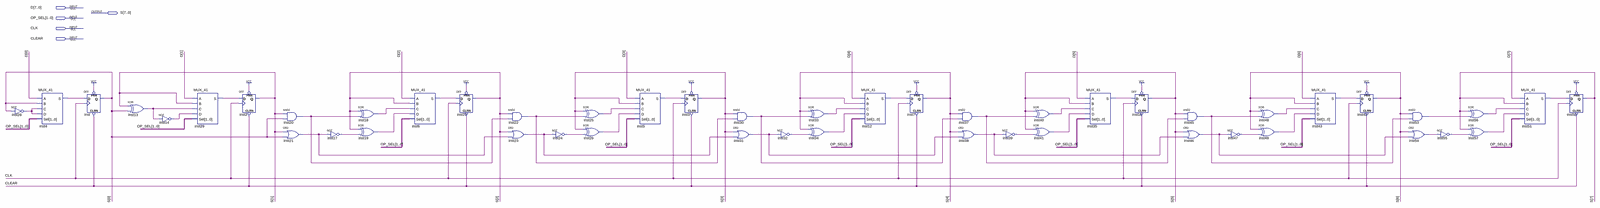
[diagram p0: schematic sheet, whole]
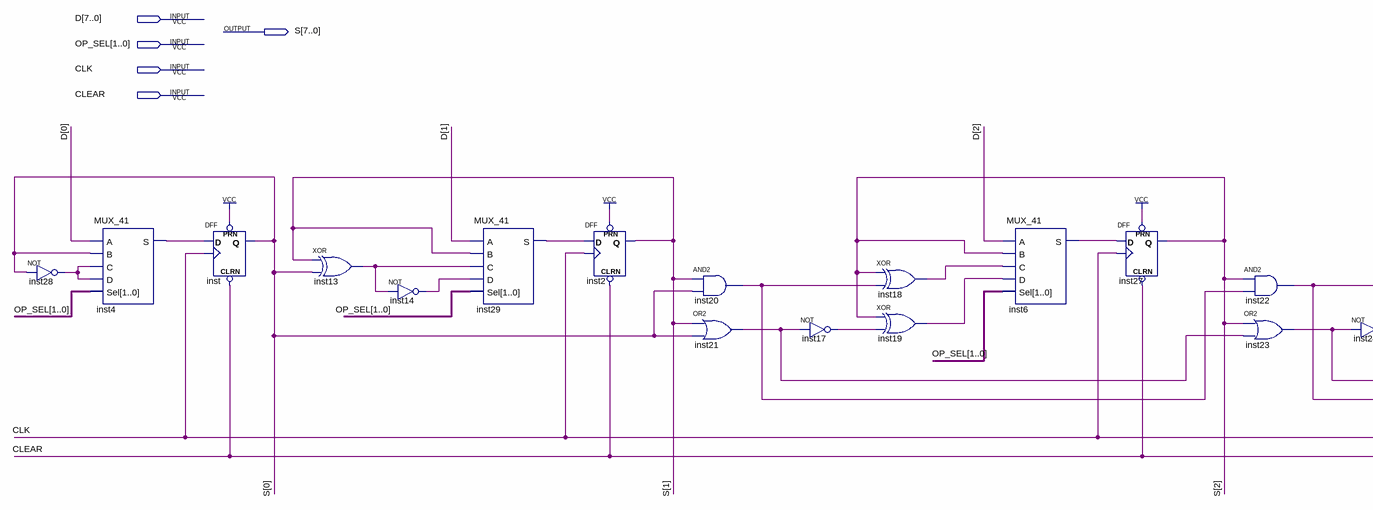
[diagram p1: schematic sheet, left part]
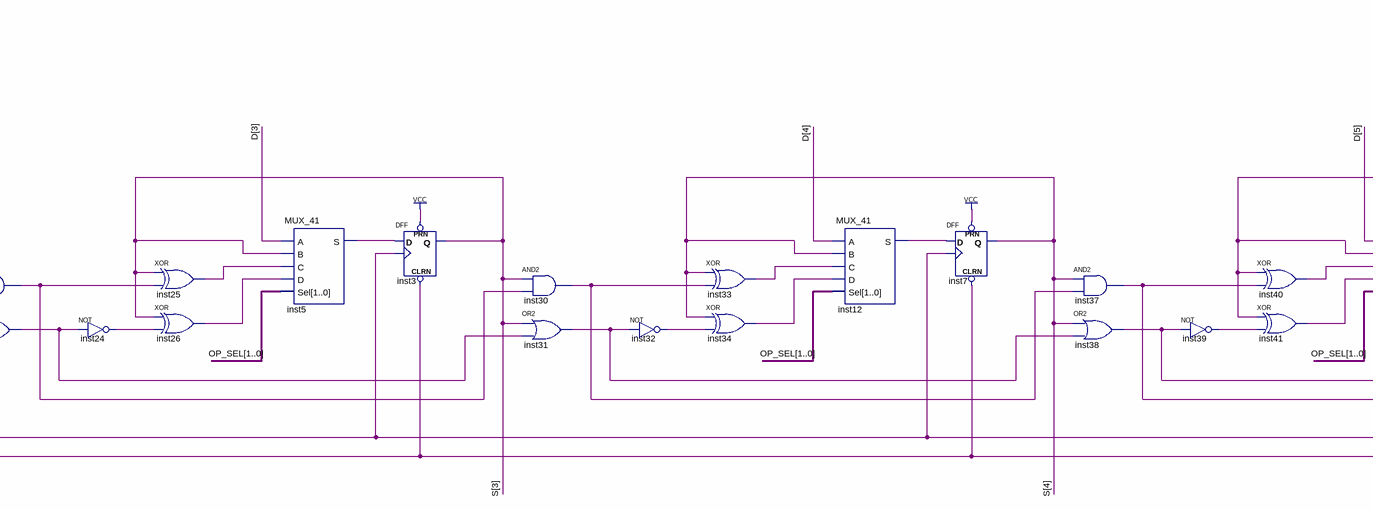
[diagram p2: schematic sheet, centre part]
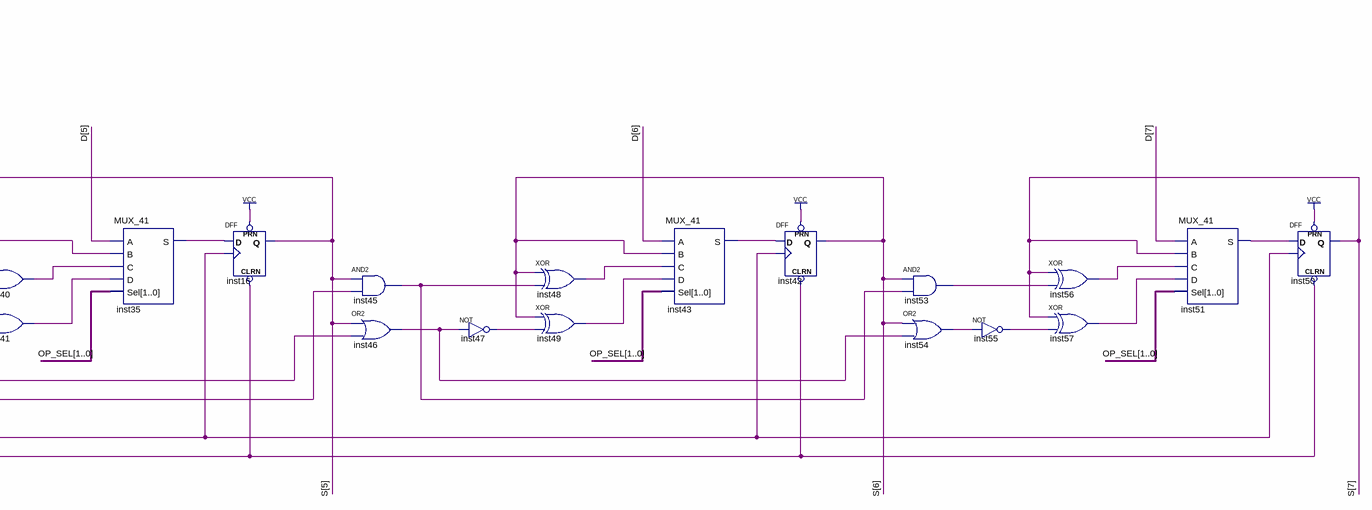
[diagram p3: schematic sheet, right part]
// Quartus schematic SYNCHRONOUS_COUNTER.bdf as structural Verilog: 49 symbols, 5 pins
module SYNCHRONOUS_COUNTER (
  input  [7:0] D,
  input  [1:0] OP_SEL,
  input  CLK,
  input  CLEAR,
  output [7:0] S
);

  wire inst4_s, inst5_s, inst6_s, inst12_s, inst13_out, inst14_out, inst17_out, inst18_out, inst19_out,
       inst20_out, inst21_out, inst22_out, inst23_out, inst24_out, inst25_out, inst26_out, inst28_out,
       inst29_s, inst30_out, inst31_out, inst32_out, inst33_out, inst34_out, inst35_s, inst37_out,
       inst38_out, inst39_out, inst40_out, inst41_out, inst43_s, inst45_out, inst46_out, inst47_out,
       inst48_out, inst49_out, inst51_s, inst53_out, inst54_out, inst55_out, inst56_out, inst57_out;

  not inst28 (inst28_out, S[0]);
  MUX_41 inst4 (.A(D[0]), .B(S[0]), .C(inst28_out), .D(inst28_out), .Sel(OP_SEL), .S(inst4_s));
  DFF inst (.CLRN(CLEAR), .CLK(CLK), .D(inst4_s), .PRN(1'b1), .Q(S[0]));
  xor inst13 (inst13_out, S[1], S[0]);
  not inst14 (inst14_out, inst13_out);
  MUX_41 inst29 (.A(D[1]), .B(S[1]), .C(inst13_out), .D(inst14_out), .Sel(OP_SEL), .S(inst29_s));
  DFF inst2 (.CLRN(CLEAR), .CLK(CLK), .D(inst29_s), .PRN(1'b1), .Q(S[1]));
  and inst20 (inst20_out, S[1], S[0]);
  or inst21 (inst21_out, S[1], S[0]);
  not inst17 (inst17_out, inst21_out);
  xor inst18 (inst18_out, S[2], inst20_out);
  xor inst19 (inst19_out, S[2], inst17_out);
  MUX_41 inst6 (.A(D[2]), .B(S[2]), .C(inst18_out), .D(inst19_out), .Sel(OP_SEL), .S(inst6_s));
  DFF inst27 (.CLRN(CLEAR), .CLK(CLK), .D(inst6_s), .PRN(1'b1), .Q(S[2]));
  and inst22 (inst22_out, S[2], inst20_out);
  or inst23 (inst23_out, S[2], inst21_out);
  not inst24 (inst24_out, inst23_out);
  xor inst25 (inst25_out, S[3], inst22_out);
  xor inst26 (inst26_out, S[3], inst24_out);
  MUX_41 inst5 (.A(D[3]), .B(S[3]), .C(inst25_out), .D(inst26_out), .Sel(OP_SEL), .S(inst5_s));
  DFF inst3 (.CLRN(CLEAR), .CLK(CLK), .D(inst5_s), .PRN(1'b1), .Q(S[3]));
  and inst30 (inst30_out, S[3], inst22_out);
  or inst31 (inst31_out, S[3], inst23_out);
  not inst32 (inst32_out, inst31_out);
  xor inst33 (inst33_out, S[4], inst30_out);
  xor inst34 (inst34_out, S[4], inst32_out);
  MUX_41 inst12 (.A(D[4]), .B(S[4]), .C(inst33_out), .D(inst34_out), .Sel(OP_SEL), .S(inst12_s));
  DFF inst7 (.CLRN(CLEAR), .CLK(CLK), .D(inst12_s), .PRN(1'b1), .Q(S[4]));
  and inst37 (inst37_out, S[4], inst30_out);
  or inst38 (inst38_out, S[4], inst31_out);
  not inst39 (inst39_out, inst38_out);
  xor inst40 (inst40_out, S[5], inst37_out);
  xor inst41 (inst41_out, S[5], inst39_out);
  MUX_41 inst35 (.A(D[5]), .B(S[5]), .C(inst40_out), .D(inst41_out), .Sel(OP_SEL), .S(inst35_s));
  DFF inst16 (.CLRN(CLEAR), .CLK(CLK), .D(inst35_s), .PRN(1'b1), .Q(S[5]));
  and inst45 (inst45_out, S[5], inst37_out);
  or inst46 (inst46_out, S[5], inst38_out);
  not inst47 (inst47_out, inst46_out);
  xor inst48 (inst48_out, S[6], inst45_out);
  xor inst49 (inst49_out, S[6], inst47_out);
  MUX_41 inst43 (.A(D[6]), .B(S[6]), .C(inst48_out), .D(inst49_out), .Sel(OP_SEL), .S(inst43_s));
  DFF inst42 (.CLRN(CLEAR), .CLK(CLK), .D(inst43_s), .PRN(1'b1), .Q(S[6]));
  and inst53 (inst53_out, S[6], inst45_out);
  or inst54 (inst54_out, S[6], inst46_out);
  not inst55 (inst55_out, inst54_out);
  xor inst56 (inst56_out, S[7], inst53_out);
  xor inst57 (inst57_out, S[7], inst55_out);
  MUX_41 inst51 (.A(D[7]), .B(S[7]), .C(inst56_out), .D(inst57_out), .Sel(OP_SEL), .S(inst51_s));
  DFF inst50 (.CLRN(CLEAR), .CLK(CLK), .D(inst51_s), .PRN(1'b1), .Q(S[7]));
endmodule
